# Altium schematic sheet debug.SchDoc
size A4; SheetNumber: 5; SheetTotal: 5
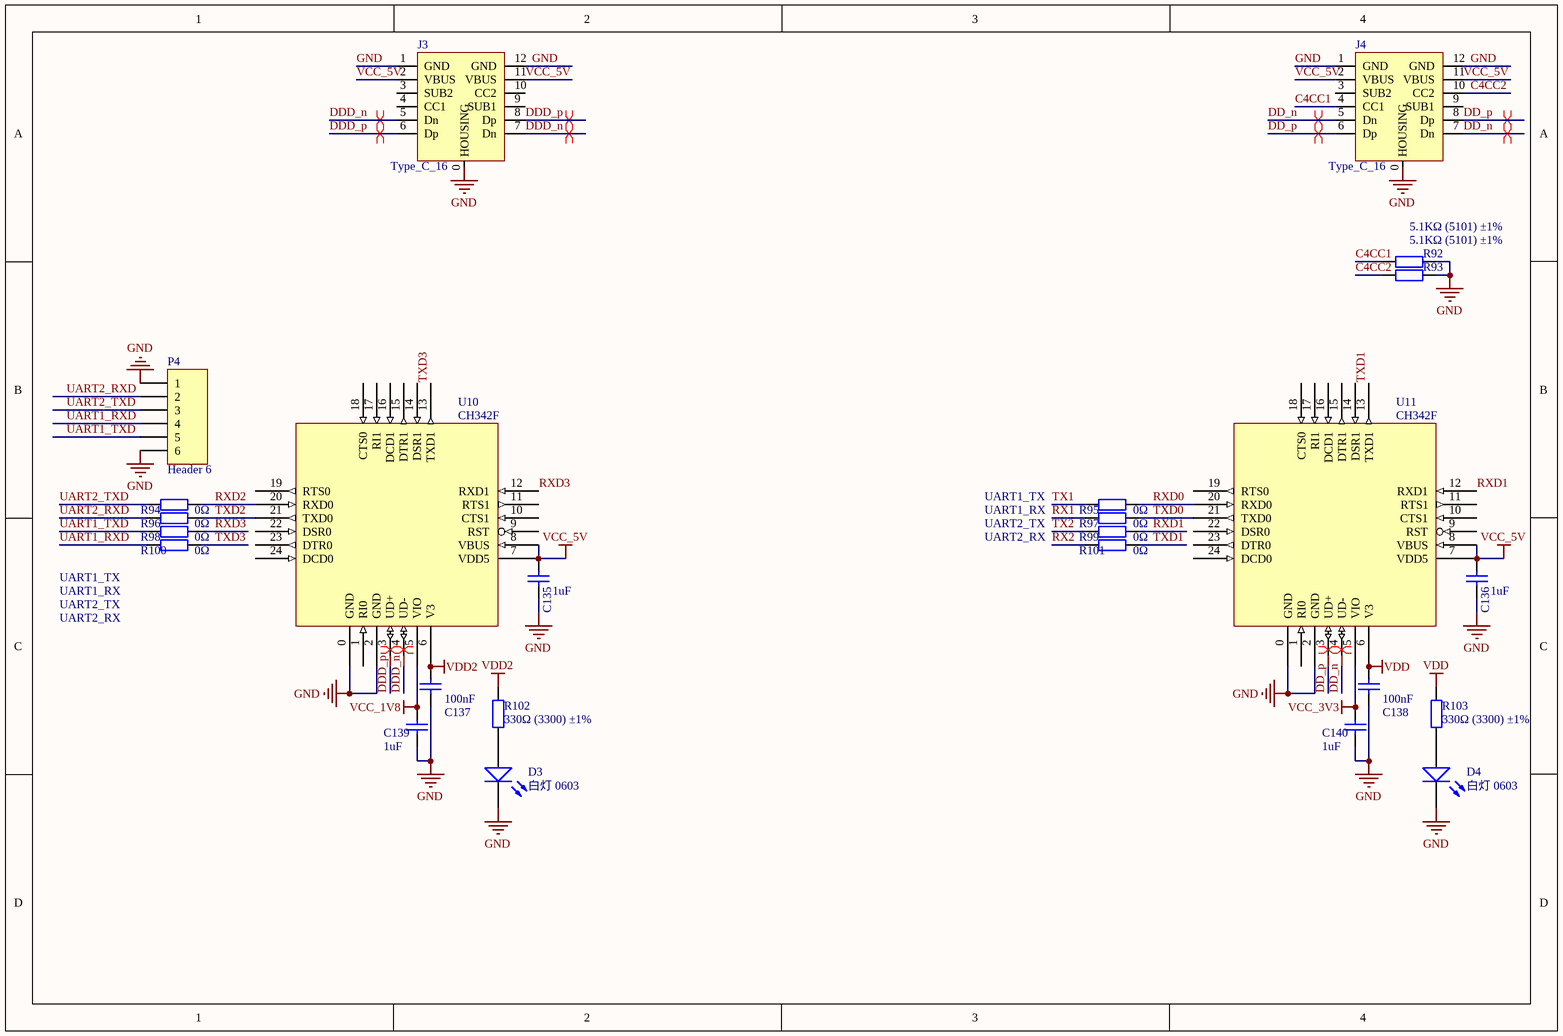
[diagram p0: debug.SchDoc]

## Parts
C135  1uF  [0805_C]
C136  1uF  [0402_C]
C137  100nF  [0805_C]
C138  100nF  [0402_C]
C139  1uF  [0805_C]
C140  1uF  [0402_C]
D3  白灯 0603  [0805_LED_S1]
D4  白灯 0603  [0805_LED_S1]
J3  Type_C_16  [USB type C  16pin]
J4  Type_C_16  [USB type C  16pin]
P4  Header 6  [HDR1X6]
R92  5.1KΩ (5101) ±1%  [0402_R]
R93  5.1KΩ (5101) ±1%  [0402_R]
R94  0Ω  [0805_R]
R95  0Ω  [0805_R]
R96  0Ω  [0805_R]
R97  0Ω  [0805_R]
R98  0Ω  [0805_R]
R99  0Ω  [0805_R]
R100  0Ω  [0805_R]
R101  0Ω  [0805_R]
R102  330Ω (3300) ±1%  [0805_R]
R103  330Ω (3300) ±1%  [0805_R]
U10  CH342F  [QFN24_4X4]
U11  CH342F  [QFN24_4X4]

## Nets
GND: C135.1 C136.1 C137.1 C138.1 C139.1 C140.1 D3.K D4.K J3.0(HOUSING) J3.1(GND) J3.12(GND) J4.0(HOUSING) J4.1(GND) J4.12(GND) P4.1 P4.6 R92.1 R93.1 U10.0(GND) U10.2(GND) U11.0(GND) U11.2(GND)
VCC_1V8: C139.2 U10.5(VIO)
VCC_3V3: C140.2 U11.5(VIO)
VCC_5V: C135.2 C136.2 J3.2(VBUS) J3.11(VBUS) J4.2(VBUS) J4.11(VBUS) U10.7(VDD5) U10.8(VBUS) U11.7(VDD5) U11.8(VBUS)
VDD: C138.2 R103.2 U11.6(V3)
VDD2: C137.2 R102.2 U10.6(V3)
C4CC1: J4.4(CC1) R92.2
C4CC2: J4.10(CC2) R93.2
DD_n: J4.5(Dn) J4.7(Dn) U11.4(UD-)
DD_p: J4.6(Dp) J4.8(Dp) U11.3(UD+)
DDD_n: J3.5(Dn) J3.7(Dn) U10.4(UD-)
DDD_p: J3.6(Dp) J3.8(Dp) U10.3(UD+)
RX1: R97.1
RX2: R101.1
RXD0: R95.2 U11.20(RXD0)
RXD1: R99.2 U11.12(RXD1)
RXD2: R94.2 U10.20(RXD0)
RXD3: R98.2 U10.12(RXD1)
TX1: R95.1
TX2: R99.1
TXD0: R97.2 U11.21(TXD0)
TXD1: R101.2 U11.13(TXD1)
TXD2: R96.2 U10.21(TXD0)
TXD3: R100.2 U10.13(TXD1)
UART1_RXD: P4.4 R100.1
UART1_TXD: P4.5 R98.1
UART2_RXD: P4.2 R96.1
UART2_TXD: P4.3 R94.1
NetD3_A: D3.A R102.1
NetD4_A: D4.A R103.1

Not connected (* = marked no-connect by the designer): J3 3(SUB2) 4(CC1) 9(SUB1) 10(CC2); J4 3(SUB2) 9(SUB1); U10 1(RI0) 9(RST) 10(CTS1) 11(RTS1) 14(DSR1) 15(DTR1) 16(DCD1) 17(RI1) 18(CTS0) 19(RTS0) 22(DSR0) 23(DTR0) 24(DCD0); U11 1(RI0) 9(RST) 10(CTS1) 11(RTS1) 14(DSR1) 15(DTR1) 16(DCD1) 17(RI1) 18(CTS0) 19(RTS0) 22(DSR0) 23(DTR0) 24(DCD0)

## Layout directives
differential pair: DD_n, DD_p, DDD_n, DDD_p

## Notes on the sheet
- UART1_TX
- UART1_RX
- UART2_TX
- UART2_RX

## Library data of the parts
C135 C136 C139 C140 = 0603 1uF (105) 10% 50V: 贴片电容; ComponentLink1Description: 供应商链接; ComponentLink1URL: http://www.szlcsc.com/product/details_16531.html; Package: 0603; Supplier: LC; SuppliersPartNumber: C15849
C137 C138 = 0402 100nF (104) 10% 16V: 贴片电容; ComponentLink1Description: 供应商链接; ComponentLink1URL: http://www.szlcsc.com/product/details_1877.html; Package: 0402; Supplier: LC; SuppliersPartNumber: C1525
D3 D4 = 0603 白灯: 发光二极管; ComponentLink1Description: 供应商链接; ComponentLink1URL: http://www.szlcsc.com/product/details_2663.html; Package: 0603; Supplier: LC; SuppliersPartNumber: C2290
J3 J4 = Type_C_16: USB type C 16pin
P4 = Header 6: Header, 6-Pin; LatestRevisionDate: 17-Jul-2002; LatestRevisionNote: Re-released for DXP Platform.; Publisher: Altium Limited
R92 R93 = 0402 5.1KΩ (5101) 1%: 贴片电阻; ComponentLink1Description: 供应商链接; ComponentLink1URL: http://www.szlcsc.com/product/details_26648.html; Package: 0402; Supplier: LC; SuppliersPartNumber: C25905
R94-R101 = 0805 0Ω (0R0) 1%: 贴片电阻; ComponentLink1Description: 供应商链接; ComponentLink1URL: http://www.szlcsc.com/product/details_18165.html; Package: 0805; Supplier: LC; SuppliersPartNumber: C17477
R102 R103 = 0402 330Ω (3300) 1%: 贴片电阻; ComponentLink1Description: 供应商链接; ComponentLink1URL: http://www.szlcsc.com/product/details_25847.html; Package: 0402; Supplier: LC; SuppliersPartNumber: C25104
U10 U11 = CH342F: USB to dual enhanced TTL Serial / 2*UART